# EasyEDA schematic SCH_rfid2final_2025-07-08 (1).json
TITLE: Sheet_1; REV: 1.0; Date: 2025-07-07; Sheet: 1/1; Company: Your Company
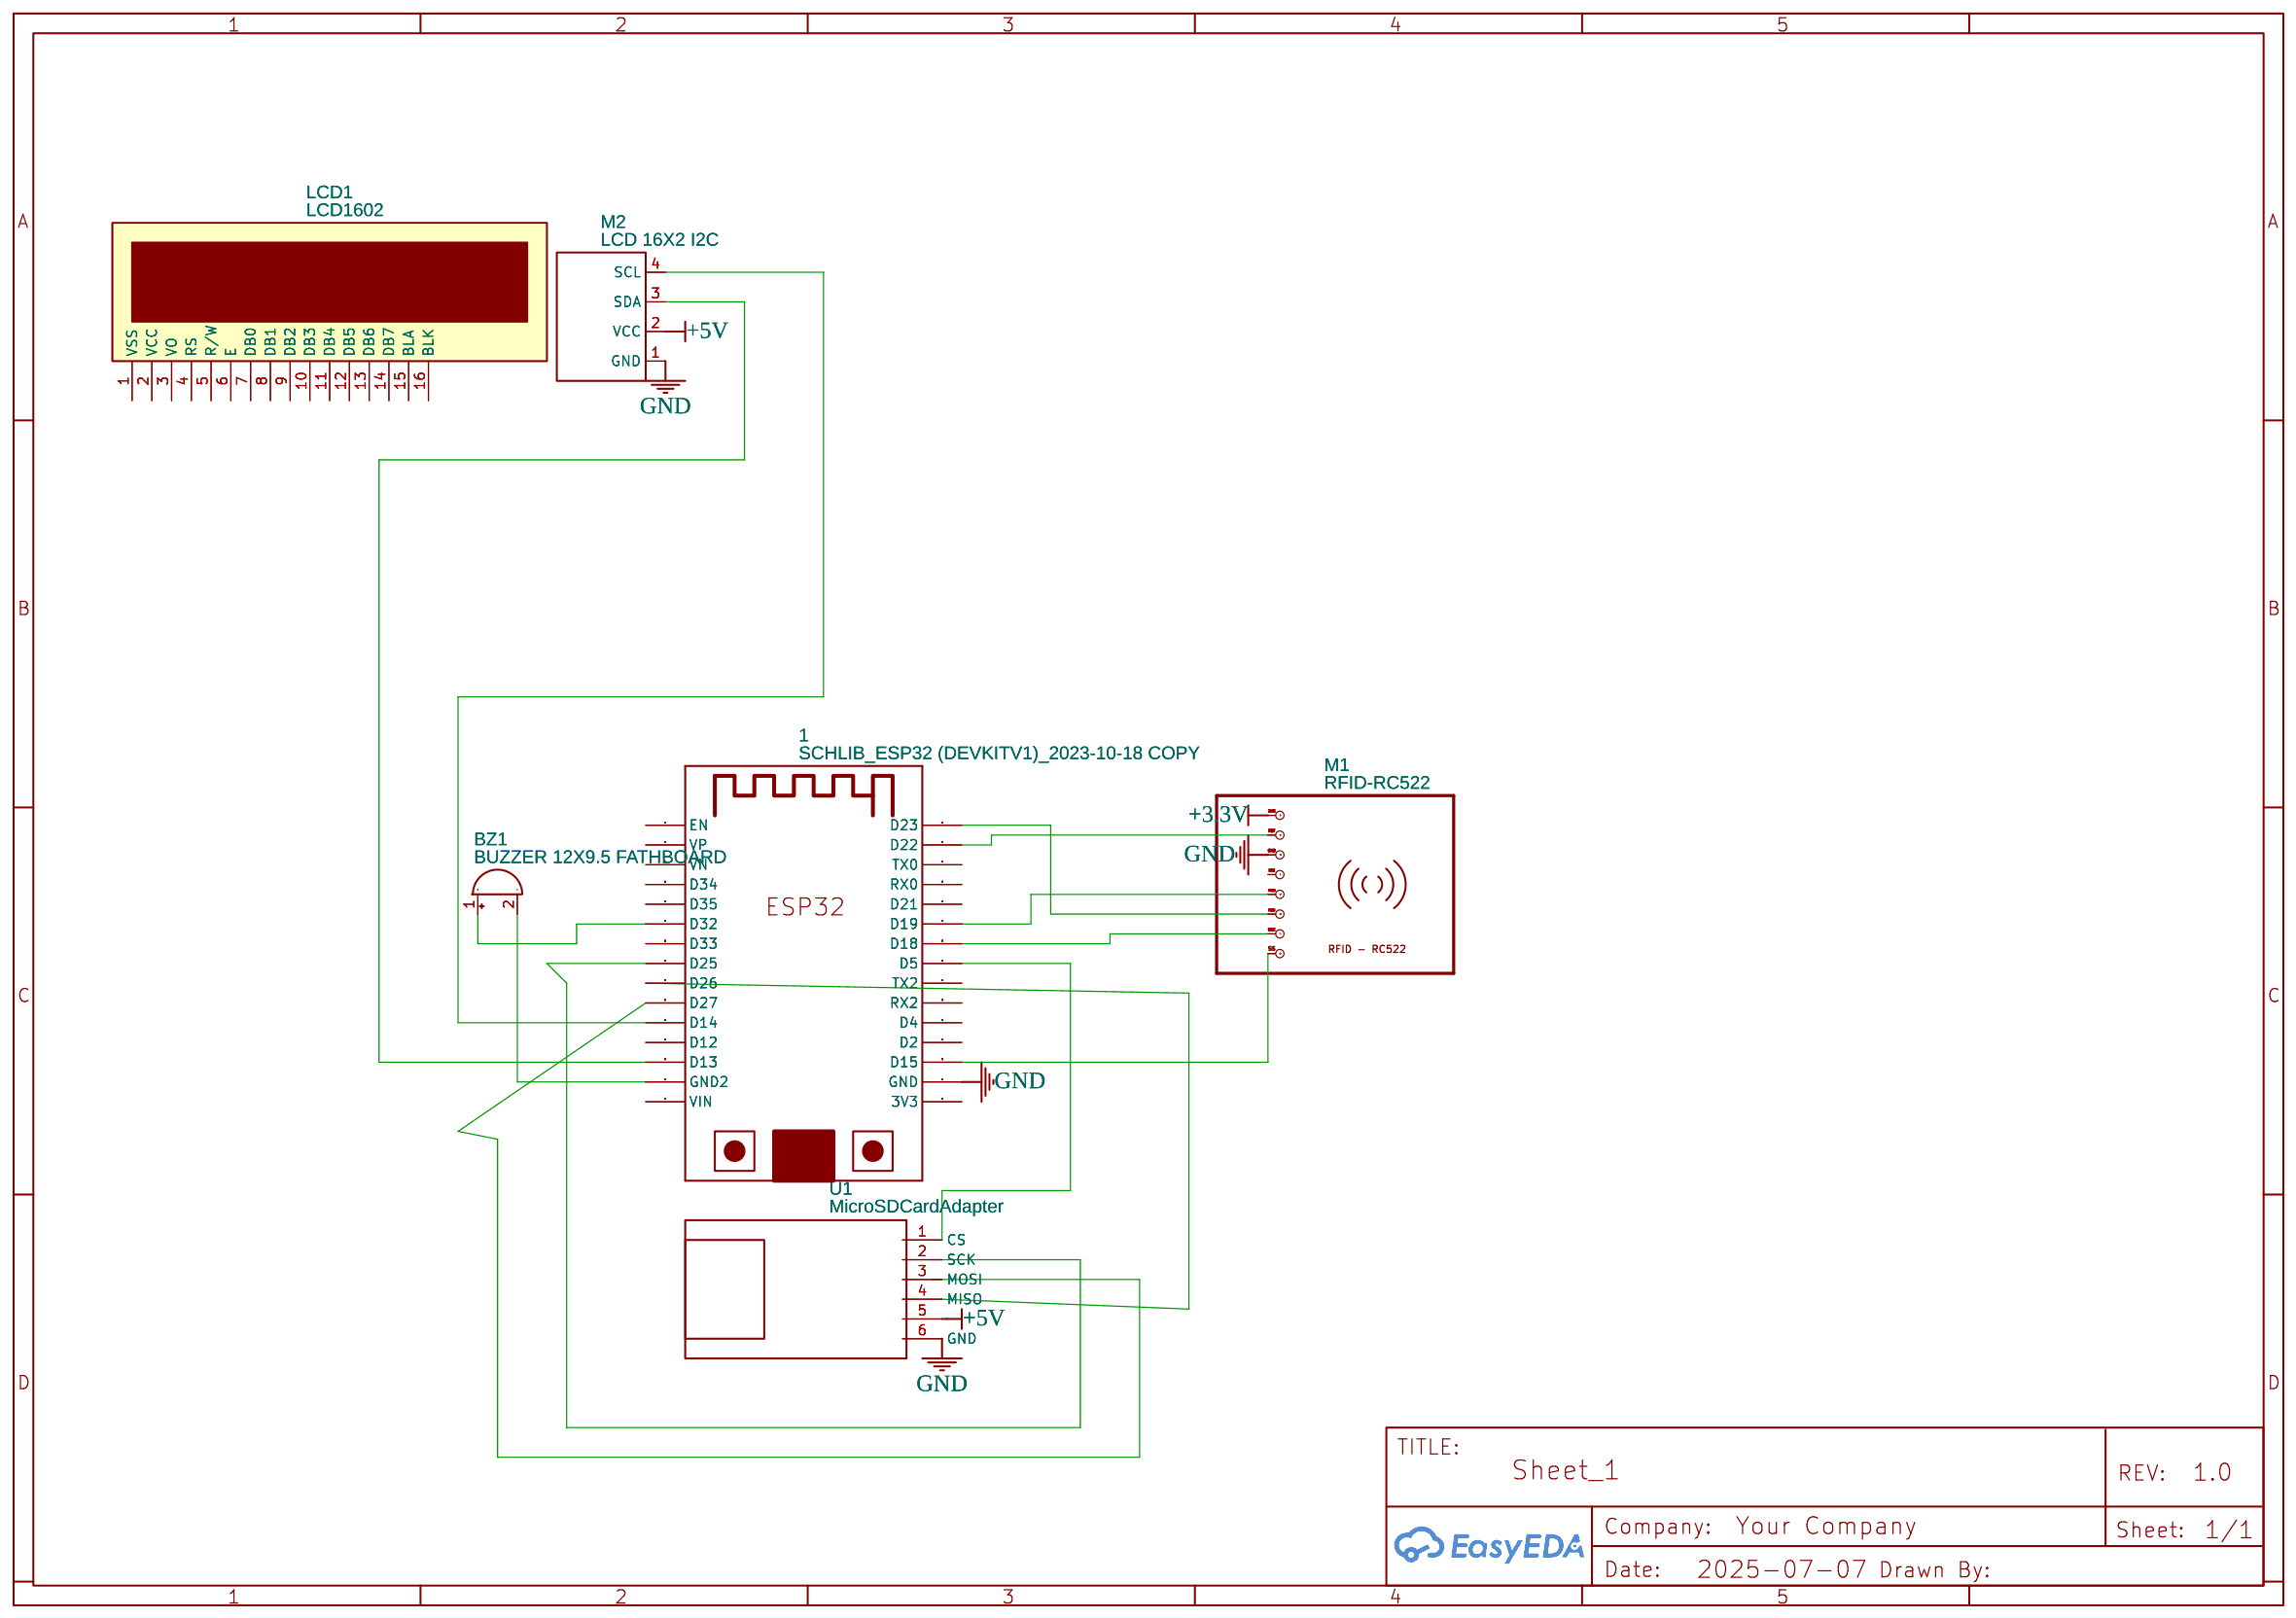
[diagram p0: schematic sheet]

## Parts
1  SCHLIB_ESP32 (DEVKITV1)_2023-10-18 COPY  [ESP32-DEVKITV1_ESP32-DEVKITV1]
BZ1  BUZZER 12X9.5 FATHBOARD  [BUZZER_BEEPER:BUZZER_12X9.5RM7.6]
LCD1  LCD1602  [LCD1602]
M1  RFID-RC522  [RFID-RC522]
M2  LCD 16X2 I2C  [I2C LCD1602 I2C]
U1  MicroSDCardAdapter  [MICROSDCARDADAPTER]

## Library data of the parts
1 = ESP32-DEVKIT-V1-30PIN: Contributor: kibandesteven
BZ1 = BUZZER 12X9.5 FATHBOARD: Symbol: Device_Buzzer; Device: Device_Buzzer; Add into BOM: yes; Convert to PCB: yes; Origin Footprint: Buzzer_Beeper:Buzzer_12x9.5RM7.6; Contributor: rjklcr003
LCD1 = LCD1602: Manufacturer: LONTECH(厦门龙特); Manufacturer Part: LCM1602K-NSW-BBW; Supplier Part: C83275; Supplier: LCSC; Contributor: LCEDA_Lib
M1 = RFID-RC522: Contributor: stufi1983
M2 = LCD 16X2 I2C: Contributor: tshepangmokhele2383
U1 = MicroSDCardAdapter: Contributor: Itjad Goalkes; Package Display: No

## Nets
+3.3V: M1.3V3(1)
+5V: M2.2(VCC)
GND: 1.GND M1.GND(3) M2.1(GND)
Net-(1-D13): 1.D13 M2.3(SDA)
Net-(1-D14): 1.D14 M2.4(SCL)
Net-(1-D15): 1.D15 M1.SS(8)
Net-(1-D18): 1.D18 M1.SCK(7)
Net-(1-D19): 1.D19 M1.MISO(5)
Net-(1-D22): 1.D22 M1.RST(2)
Net-(1-D23): 1.D23 M1.MOSI(6)
Net-(1-D32): 1.D32 BZ1.1(+)
Net-(1-GND2): 1.GND2 BZ1.2(-)

Not connected (* = marked no-connect by the designer): 1 3V3 D2 D4 D5 D12 D21 D25 D26 D27 D33 D34 D35 EN RX0 RX2 TX0 TX2 VIN VN VP; LCD1 1(VSS) 2(VCC) 3(VO) 4(RS) 5(R/W) 6(E) 7(DB0) 8(DB1) 9(DB2) 10(DB3) 11(DB4) 12(DB5) 13(DB6) 14(DB7) 15(BLA) 16(BLK); M1 IRQ(4); U1 1(CS) 2(SCK) 3(MOSI) 4(MISO) 5(VCC) 6(GND)
